# Altium project PCB.PrjPcb
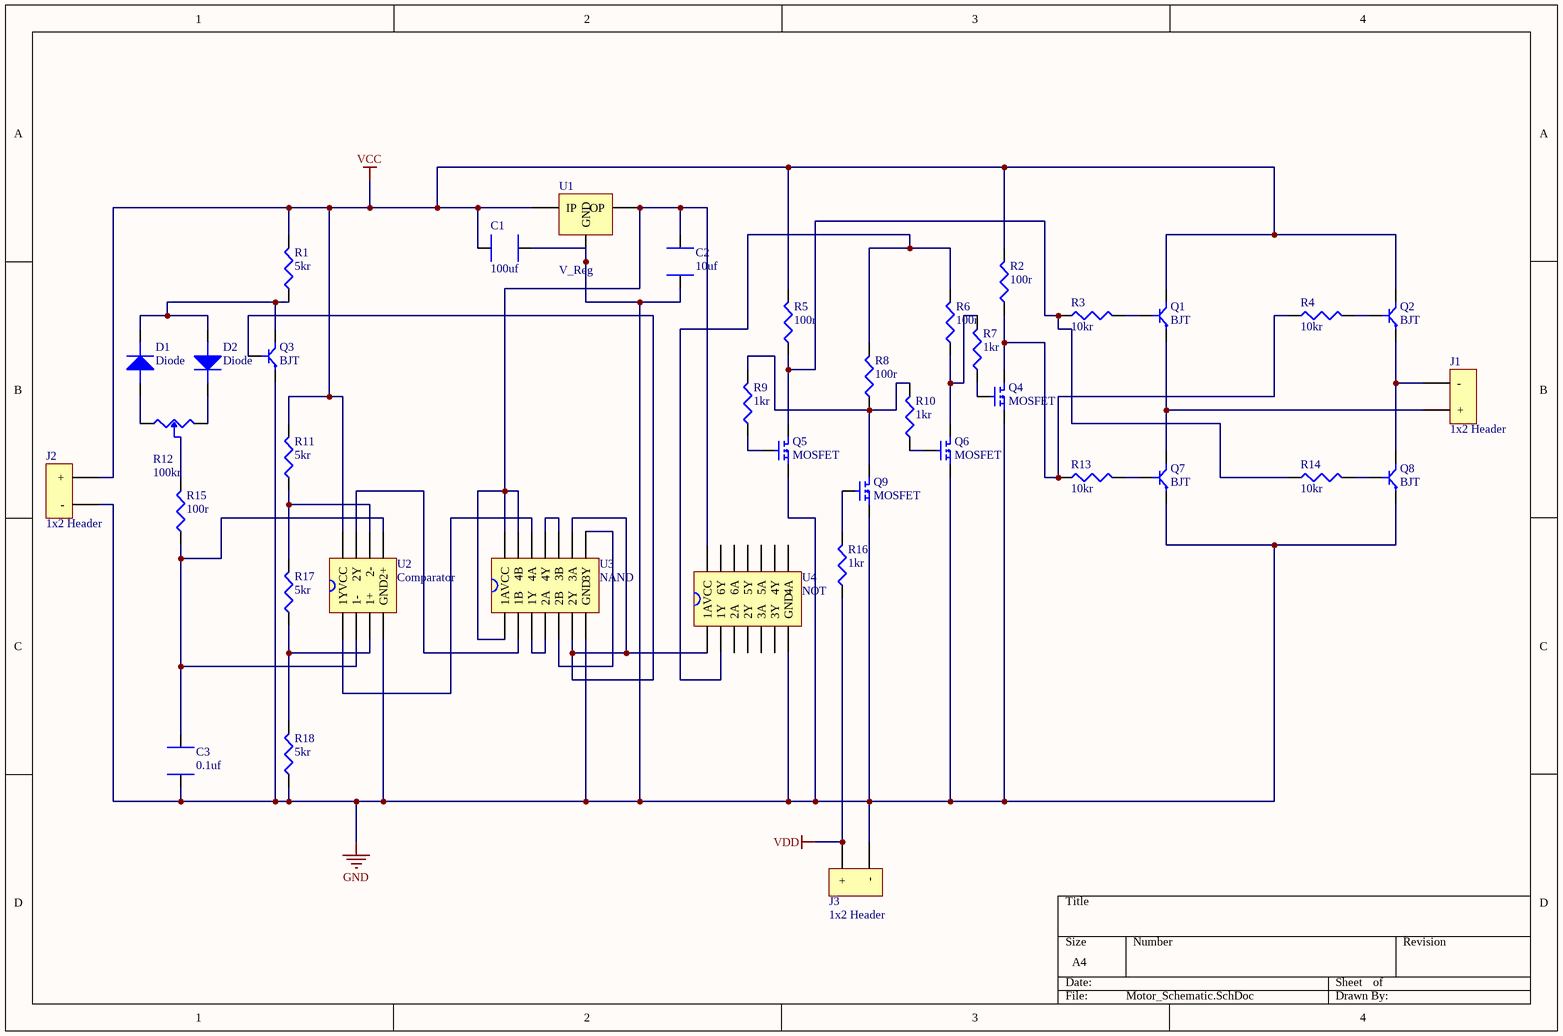
[diagram p0: Motor_Schematic.SchDoc]
1 sheet, 39 parts. Net scope: global (net labels, ports and power ports of the same name join across sheets).
Board file: Motor_PCB.PcbDoc

## Sheet Motor_Schematic.SchDoc
size A4

### Parts
C1  100uf  [100UF]
C2  10uf  [10UF]
C3  0.1uf  [0.1UF]
D1  Diode  [Diode]
D2  Diode  [Diode]
J1  1x2 Header  [HDR1X2]
J2  1x2 Header  [HDR1X2]
J3  1x2 Header  [HDR1X2]
Q1  BJT  [BJT]
Q2  BJT  [BJT]
Q3  BJT  [BJT]
Q4  MOSFET  [MOSFET]
Q5  MOSFET  [MOSFET]
Q6  MOSFET  [MOSFET]
Q7  BJT  [BJT]
Q8  BJT  [BJT]
Q9  MOSFET  [MOSFET]
R1  5kr  [5KR]
R2  100r  [100R]
R3  10kr  [10kr]
R4  10kr  [10kr]
R5  100r  [100R]
R6  100r  [100R]
R7  1kr  [1KR]
R8  100r  [100R]
R9  1kr  [1KR]
R10  1kr  [1KR]
R11  5kr  [5KR]
R12  100kr  [POT]
R13  10kr  [10kr]
R14  10kr  [10kr]
R15  100r  [100R]
R16  1kr  [1KR]
R17  5kr  [5KR]
R18  5kr  [5KR]
U1  V_Reg  [V_REG]
U2  Comparator  [COMP]
U3  NAND  [NAND]
U4  NOT  [NOT]

### Nets
GND: C1.2 C2.1 C3.1 J2.2(-) J3.2(-) Q3.3 Q4.3 Q5.3 Q6.3 Q7.3 Q8.3 Q9.3 R18.1 U1.2(GND) U2.4(GND) U3.7(GND) U4.7(GND)
VCC: C1.1 J2.1(+) Q1.1 Q2.1 R1.2 R2.2 R5.2 R11.2 U1.1(IP) U2.8(VCC)
VDD: J3.1(+) R16.1
NetC2_2: C2.2 U1.3(OP) U3.1(1A) U3.13(4B) U3.14(VCC) U4.14(VCC)
NetC3_2: C3.2 R15.1 U2.2(1-) U2.5(2+)
NetD1_1: D1.1 D2.2 Q3.1 R1.1
NetD1_2: D1.2 R12.3
NetD2_1: D2.1 R12.1
NetJ1_1: J1.1(+) Q1.3 Q7.1
NetJ1_2: J1.2(-) Q2.3 Q8.1
NetQ1_2: Q1.2 R3.2
NetQ2_2: Q2.2 R4.2
NetQ3_2: Q3.2 U3.6(2Y) U3.9(3A) U4.1(1A)
NetQ4_1: Q4.1 R2.1 R4.1 R13.1
NetQ4_2: Q4.2 R7.1
NetQ5_1: Q5.1 R3.1 R5.1 R14.1
NetQ5_2: Q5.2 R9.1
NetQ6_1: Q6.1 R6.1 R7.2
NetQ6_2: Q6.2 R10.1
NetQ7_2: Q7.2 R13.2
NetQ8_2: Q8.2 R14.2
NetQ9_1: Q9.1 R8.1 R9.2 R10.2
NetQ9_2: Q9.2 R16.2
NetR6_2: R6.2 R8.2 U4.2(1Y)
NetR11_1: R11.1 R17.2 U2.6(2-)
NetR12_2: R12.2 R15.2
NetR17_1: R17.1 R18.2 U2.3(1+)
NetU2_1: U2.1(1Y) U3.12(4A)
NetU2_7: U2.7(2Y) U3.2(1B)
NetU3_3: U3.3(1Y) U3.4(2A)
NetU3_5: U3.5(2B) U3.8(3Y)
NetU3_10: U3.10(3B) U3.11(4Y)

Not connected (* = marked no-connect by the designer): U4 3(2A) 4(2Y) 5(3A) 6(3Y) 8(4A) 9(4Y) 10(5A) 11(5Y) 12(6A) 13(6Y)

### Library data of the parts
C1 = FK22Y5V1A107Z: CAP CER 100UF 10V Y5V RADIAL; Manufacturer: TDK; Tolerance: 80%; Lead/Base Style: Kinked; Lead Length: 7mm; Supplier 1: Avnet; Supplier Part Number 1: FK22Y5V1A107Z; Manufacturer Part Number: FK22Y5V1A107Z; RoHS: Yes; Category: Ceramic Capacitors; Mount: Through Hole; Case/Package: Radial; Min Operating Temperature: -30°C; Max Operating Temperature: 85°C; Packaging: Bulk; Capacitance: 100uF; Package Quantity: 500; Voltage Rating: 10V; Dielectric: Y5V; Termination: Radial; Voltage Rating (DC): 10V; Series: FK; Length: 0.295inch; Width: 0.157inch; Height: 8mm; Lead Pitch: 5mm; Height - Seated (Max): 0.315inch; Radiation Hardening: No; Lead Free: Lead Free; RoHS Compliant: Yes; ComponentLink1URL: https://datasheet.ciiva.com/160/leadmlcc-commercial-general-en-160679.pdf?src-supplier=Digi-Key; ComponentLink1Description: https://datasheet.ciiva.com/160/leadmlcc-commercial-general-en-160679.pdf?src-supplier=Digi-Key
C2 = FK20X7R1E106MR000: Cap Ceramic 10uF 25V X7R 20% Radial 5mm 125°C Bulk; Manufacturer: TDK; Supplier 1: DigiKey; Supplier Part Number 1: 445-FK20X7R1E106MR000-ND; Manufacturer Part Number: FK20X7R1E106MR000; Category: Ceramic Capacitors; Stock 1: 500; Pricing 1: 1=0.87000, 10=0.64200, 50=0.51340, 100=0.44010, 500=0.34840, 1000=0.29339, 2500=0.27506, 5000=0.25672 (USD); Case/Package: Radial; ComponentLink1URL: http://product.tdk.com/en/catalog/datasheets/leadmlcc_commercial_general_en.pdf?src-supplier=Avnet; ComponentLink1Description: http://product.tdk.com/en/catalog/datasheets/leadmlcc_commercial_general_en.pdf?src-supplier=Avnet
C3 = M39014/01-1553: Cap Ceramic 0.1uF 50V X7R 10% Radial 5.08mm (0.01%FR) 125°C Bulk; Manufacturer: KEMET; Capacitance: 100nF; Lead/Base Style: Formed Leads; Supplier 1: Digi-Key; Supplier Part Number 1: 1001-2186-ND; Manufacturer Part Number: M39014/01-1553; RoHS: No; Category: Ceramic Capacitors; Stock 1: 21269; Pricing 1: 1=1.75000, 10=1.38200, 50=1.19780, 100=1.03650, 500=0.78316, 1000=0.69102, 2500=0.64495, 5000=0.62192 (USD); Mount: Through Hole; Case/Package: Radial; Min Operating Temperature: -55°C; Max Operating Temperature: 125°C; Tolerance: 10%; Packaging: Bulk; Package Quantity: 100; Voltage Rating: 50V; Dielectric: X7R; Failure Rate: 0.01%; Features: Military; Series: Military, MIL-PRF-39014, CKR05; Construction: RADIAL; Length: 0.19inch; Width: 0.09inch; Height - Seated (Max): 0.2inch; Lead Pitch: 0.2inch; Depth: 2.29mm; RoHS Compliant: No; ComponentLink1URL: http://components.arrow.com/part/dataview/4268595S5964331N4387?src-supplier=Arrow+Electronics; ComponentLink1Description: http://components.arrow.com/part/dataview/4268595S5964331N4387?src-supplier=Arrow+Electronics; ComponentLink2URL: http://www.kemet.com/docfinder?Partnumber=C052T104K5X5CR&src-supplier=Digi-Key; ComponentLink2Description: http://www.kemet.com/docfinder?Partnumber=C052T104K5X5CR&src-supplier=Digi-Key
D1 D2 = 1N4001G-T: DIODE GEN PURP 50V 1A DO41; Manufacturer: Diodes; Max Surge Current: 30A; Recovery Time: 2us; Forward Voltage: 1V; Max Reverse Current: 5uA; Element Configuration: Single; Polarity: Standard; Capacitance: 8pF; Supplier 1: Digi-Key; Supplier Part Number 1: 1N4001GDICT-ND; Manufacturer Part Number: 1N4001G-T; RoHS: Yes; Category: Rectifier Diodes; Stock 1: 29157; Pricing 1: 1=0.33000, 10=0.27300, 100=0.14480, 500=0.09528, 1000=0.06480, 2000=0.05845 (USD); Mount: Through Hole; Case/Package: DO-41; Number of Pins: 2; Weight: 0.010582oz; Contact Plating: Tin; Min Operating Temperature: -65°C; Max Operating Temperature: 175°C; Package Quantity: 5000; Packaging: Tape and Reel; Reverse Voltage (DC): 50V; Average Rectified Current: 1A; Reverse Recovery Time: 2us; Max Repetitive Reverse Voltage (Vrrm): 50V; Peak Non-Repetitive Surge Current: 30A; Forward Current: 1A; Voltage Rating (DC): 50V; Current Rating: 1A; Output Current: 1A; Max Reverse Voltage (DC): 50V; Series: -; Length: 5.21mm; Width: 2.72mm; Height: 2.72mm; Radiation Hardening: No; Lead Free: Lead Free; RoHS Compliant: Yes; ComponentLink1URL: https://datasheet.ciiva.com/4453/ds29002-87001-4453648.pdf?src-supplier=Mouser; ComponentLink1Description: https://datasheet.ciiva.com/4453/ds29002-87001-4453648.pdf?src-supplier=Mouser; ComponentLink2URL: https://datasheet.ciiva.com/8301/ds29002-8301703.pdf?src-supplier=Avnet; ComponentLink2Description: https://datasheet.ciiva.com/8301/ds29002-8301703.pdf?src-supplier=Avnet; ComponentLink3URL: https://datasheet.ciiva.com/25947/ds29002-25947001.pdf?src-supplier=Avnet+Europe; ComponentLink3Description: https://datasheet.ciiva.com/25947/ds29002-25947001.pdf?src-supplier=Avnet+Europe
J1-J3 = 22-29-2021: Conn Wire to Board HDR 2 POS 2.54mm Solder ST Thru-Hole Bag; Manufacturer: Molex; Number of Positions: 2; Connector Type: Header,Male Pin; Gender: Male; Voltage Rating (DC): 250V; Contact Post Length: 0.14inch; Glow Wire Compliant: Non-compliant; Supplier 1: Avnet; Supplier Part Number 1: 0022292021; Manufacturer Part Number: 22-29-2021; RoHS: Yes; Category: Headers and Wire Housings; Stock 1: 41330; Pricing 1: 1=0.20078, 10=0.19794, 30=0.19509, 50=0.19224, 100=0.18797, 250=0.18370, 500=0.17942 (USD); Mount: Through Hole; Color: White; Contact Plating: Gold; Contact Material: Brass; Contact Shape: Square; Insulation Material: Nylon; Insulation Color: Natural; Max Operating Temperature: 80°C; Number of Rows: 1; Packaging: Bag; Termination: Solder; Fastening Type: Friction; Contact Mating Length: 0.295inch; Insulation Height: 0.461inch; Lead Free: Lead Free; Halogen Free: Low Halogen; Flammability Rating: UL94 V-0; ComponentLink1URL: https://datasheet.ciiva.com/70131/022292021-sd-70131706.pdf?src-supplier=Digi-Key; ComponentLink1Description: https://datasheet.ciiva.com/70131/022292021-sd-70131706.pdf?src-supplier=Digi-Key
Q1-Q3 Q7 Q8 = 2N2222A: TRANS NPN 40V 0.8A TO-18; Manufacturer: Central Semiconductor; Frequency: 250MHz; hFE Min: 35; Max Power Dissipation: 500mW; Collector Base Voltage (VCBO): 75V; Emitter Base Voltage (VEBO): 6V; Collector Emitter Saturation Voltage: 1V; Max Collector Current: 800mA; Transition Frequency: 300MHz; Number of Elements: 1; Power Dissipation: 1.2W; Element Configuration: Single; Supplier 1: Digi-Key; Supplier Part Number 1: 1514-2N2222APBFREE-ND; Manufacturer Part Number: 2N2222A; RoHS: No; Category: BJTs; Stock 1: 19427; Pricing 1: 1=2.48000, 10=2.22500, 25=2.09880, 100=1.78820, 500=1.46916, 1000=1.21730, 2500=1.18800 (USD); Mount: Through Hole; Case/Package: TO-18; Number of Pins: 3; Min Operating Temperature: -65°C; Max Operating Temperature: 200°C; Packaging: Bulk; Package Quantity: 2000; Polarity: NPN; Collector Emitter Voltage (VCEO): 40V; Collector Emitter Breakdown Voltage: 40V; Max Frequency: 300MHz; Gain Bandwidth Product: 300MHz; Series: -; Collector-emitter Voltage-Max: 1V; Radiation Hardening: No; RoHS Compliant: No; Lead Free: Lead Free; ComponentLink1URL: https://datasheet.ciiva.com/16286/2n2221a-16286747.pdf?src-supplier=Future+Electronics; ComponentLink1Description: https://datasheet.ciiva.com/16286/2n2221a-16286747.pdf?src-supplier=Future+Electronics
Q4-Q6 Q9 = 2N7000TA: Trans MOSFET N-CH 60V 0.2A 3-Pin TO-92 Ammo; Manufacturer: ON Semiconductor / Fairchild; Element Configuration: Single; Current Rating: 200mA; Fall Time: 10ns; Power Dissipation: 400mW; Drain to Source Resistance: 1.2R; Gate to Source Voltage (Vgs): 30V; Threshold Voltage: 3.9V; On-State Resistance: 5R; Input Capacitance: 50pF; Number of Elements: 1; Supplier 1: Digi-Key; Supplier Part Number 1: 2N7000TACT-ND; Manufacturer Part Number: 2N7000TA; RoHS: Yes; Category: MOSFETs; Stock 1: 145929; Pricing 1: 1=0.46000, 10=0.34300, 25=0.30040, 100=0.19430, 500=0.12870, 1000=0.09867 (USD); Mount: Through Hole; Case/Package: TO-92-3; Number of Pins: 3; Contact Plating: Copper,Tin,Silver; Min Operating Temperature: -55°C; Max Operating Temperature: 150°C; Voltage Rating (DC): 60V; Continuous Drain Current (ID): 200mA; Drain to Source Breakdown Voltage: 60V; Turn-Off Delay Time: 10ns; Drain to Source Voltage (Vdss): 60V; Turn-On Delay Time: 10ns; Package Quantity: 2000; Rise Time: 10ns; Max Power Dissipation: 400mW; Rds On Max: 5R; Packaging: Ammo Pack; Length: 5.2mm; Width: 4.19mm; Height: 5.33mm; Radiation Hardening: No; Lead Free: Lead Free; REACH SVHC: No SVHC; ComponentLink1URL: https://datasheet.ciiva.com/16743/2n7000ta-16743696.pdf?src-supplier=Future+Electronics; ComponentLink1Description: https://datasheet.ciiva.com/16743/2n7000ta-16743696.pdf?src-supplier=Future+Electronics; ComponentLink2URL: https://datasheet.ciiva.com/25625/0900766b80f9a390-25625193.pdf?src-supplier=RSComponents; ComponentLink2Description: https://datasheet.ciiva.com/25625/0900766b80f9a390-25625193.pdf?src-supplier=RSComponents; ComponentLink3URL: https://datasheet.ciiva.com/4440/2n7000bu-8139-4440256.pdf?src-supplier=Mouser; ComponentLink3Description: https://datasheet.ciiva.com/4440/2n7000bu-8139-4440256.pdf?src-supplier=Mouser; ComponentLink4URL: https://datasheet.ciiva.com/46422/1863369-46422102.pdf?src-supplier=Element14; ComponentLink4Description: https://datasheet.ciiva.com/46422/1863369-46422102.pdf?src-supplier=Element14; ComponentLink5URL: https://datasheet.ciiva.com/931/2n7000-931787.pdf?src-supplier=Digi-Key; ComponentLink5Description: https://datasheet.ciiva.com/931/2n7000-931787.pdf?src-supplier=Digi-Key; ComponentLink6URL: https://datasheet.ciiva.com/931/2n7000-931786.pdf?src-supplier=Digi-Key; ComponentLink6Description: https://datasheet.ciiva.com/931/2n7000-931786.pdf?src-supplier=Digi-Key; ComponentLink7URL: https://datasheet.ciiva.com/15208/getdatasheetpartid-157593-15208444.pdf?src-supplier=Verical; ComponentLink7Description: https://datasheet.ciiva.com/15208/getdatasheetpartid-157593-15208444.pdf?src-supplier=Verical
R1 R11 R17 R18 = RN55D5001FB14: Metal Film Resistors - Through Hole 1/8watt 5Kohms 1% 100ppm Non Std; Manufacturer: Vishay Dale; Power Rating: 125mW; Voltage Rating: 250V; Temperature Coefficient: 100ppm/°C; Lead Diameter: 0.64mm; Supplier 1: Digi-Key; Supplier Part Number 1: RN55D5001FB14-ND; Manufacturer Part Number: RN55D5001FB14; RoHS: No; Category: Through-Hole Resistors; Stock 1: 711; Pricing 1: 1=0.58000, 10=0.44800, 25=0.34120, 50=0.25360, 100=0.18850, 250=0.15924, 500=0.13650, 1000=0.10400, 5000=0.08775 (USD); Case/Package: Axial; Number of Pins: 2; Min Operating Temperature: -65°C; Max Operating Temperature: 175°C; Package Quantity: 100; Resistance: 5kR; Tolerance: 1%; Packaging: Bulk; Resistor Type: Metal Film; Termination: Axial; Number of Terminations: 2; Max Power Dissipation: 125mW; Voltage Rating (DC): 250V; Features: Moisture Resistant,Military,Flame Retardant Coating; Series: Military, MIL-R-10509/7, RN55; Resistance Tolerance: 1%; Length: 0.24inch; Width: 2.29mm; REACH SVHC: Unknown; Lead Free: Contains Lead; RoHS Compliant: No; ComponentLink1URL: https://datasheet.ciiva.com/22672/1847593-22672521.pdf?src-supplier=Element14; ComponentLink1Description: https://datasheet.ciiva.com/22672/1847593-22672521.pdf?src-supplier=Element14; ComponentLink2URL: https://datasheet.ciiva.com/5491/cmfmil-223788-5491847.pdf?src-supplier=Mouser; ComponentLink2Description: https://datasheet.ciiva.com/5491/cmfmil-223788-5491847.pdf?src-supplier=Mouser; ComponentLink3URL: https://datasheet.ciiva.com/13956/cmfmil-13956108.pdf?src-supplier=Digi-Key; ComponentLink3Description: https://datasheet.ciiva.com/13956/cmfmil-13956108.pdf?src-supplier=Digi-Key
R2 R5 R6 R8 R15 = CPF1100R00JKEE6: RESISTOR METAL FILM 1W 100 OHM; Manufacturer: Vishay Dale; Tolerance: 5%; Temperature Coefficient: 100ppm/°C; Supplier 1: Digi-Key; Supplier Part Number 1: CPF100DCT-ND; Manufacturer Part Number: CPF1100R00JKEE6; RoHS: Yes; Category: Through-Hole Resistors; Stock 1: 368; Pricing 1: 1=0.69000, 10=0.57400, 25=0.49200, 50=0.44280, 100=0.38540, 250=0.34440, 500=0.27880 (USD); Case/Package: Axial; Min Operating Temperature: -65°C; Max Operating Temperature: 230°C; Package Quantity: 1; Resistance: 100R; Packaging: Tape and Reel; Resistor Type: Metal Film; Number of Terminations: 2; Max Power Dissipation: 1W; Series: CPF; Features: Moisture Resistant; Length: 0.24inch; RoHS Compliant: Yes; ComponentLink1URL: https://datasheet.ciiva.com/2718/cpf-2718963.pdf?src-supplier=Digi-Key; ComponentLink1Description: https://datasheet.ciiva.com/2718/cpf-2718963.pdf?src-supplier=Digi-Key; ComponentLink2URL: https://datasheet.ciiva.com/2718/cpf-2718964.pdf?src-supplier=Digi-Key; ComponentLink2Description: https://datasheet.ciiva.com/2718/cpf-2718964.pdf?src-supplier=Digi-Key
R3 R4 R13 R14 = CPF110K000FKEE6: RESISTOR METAL FILM 1W 10.0K OHM; Manufacturer: Vishay Dale; Tolerance: 1%; Voltage Rating: 250V; Temperature Coefficient: 100ppm/°C; Lead Diameter: 0.64mm; Supplier 1: Digi-Key; Supplier Part Number 1: CPF10.0KCCT-ND; Manufacturer Part Number: CPF110K000FKEE6; RoHS: Yes; Category: Through-Hole Resistors; Stock 1: 37314; Pricing 1: 1=0.72000, 10=0.60200, 25=0.51600, 50=0.46440, 100=0.40420, 250=0.36120, 500=0.29240 (USD); Mount: Through Hole; Case/Package: Axial; Min Operating Temperature: -65°C; Max Operating Temperature: 230°C; Resistance: 10kR; Power Rating: 1W; Packaging: Tape and Reel; Package Quantity: 1; Resistor Type: Metal Film; Termination: Axial; Number of Terminations: 2; Max Power Dissipation: 1W; Features: Moisture Resistant; Series: CPF; Length: 0.24inch; RoHS Compliant: Yes; ComponentLink1URL: https://datasheet.ciiva.com/2725/cpf-2725244.pdf?src-supplier=Digi-Key; ComponentLink1Description: https://datasheet.ciiva.com/2725/cpf-2725244.pdf?src-supplier=Digi-Key; ComponentLink2URL: https://datasheet.ciiva.com/2725/cpf-2725245.pdf?src-supplier=Digi-Key; ComponentLink2Description: https://datasheet.ciiva.com/2725/cpf-2725245.pdf?src-supplier=Digi-Key
R7 R9 R10 R16 = MR1061K0000TAE66: RESISTOR 1.0K OHM 1/4W .01% WW; Manufacturer: Vishay Dale; Tolerance: 0.01%; Max Power Dissipation: 250mW; Temperature Coefficient: 10ppm/°C; Supplier 1: Digi-Key; Supplier Part Number 1: MR106-1K-.01-ND; Manufacturer Part Number: MR1061K0000TAE66; RoHS: Yes; Category: Through-Hole Resistors; Stock 1: 105; Pricing 1: 1=6.60000, 10=6.18800, 25=5.77520, 50=5.08760, 100=4.40000 (USD); Case/Package: Axial; Min Operating Temperature: -55°C; Max Operating Temperature: 145°C; Packaging: Bulk; Resistance: 1kR; Resistor Type: Wirewound; Number of Terminations: 2; Package Quantity: 5; Series: MR100; Length: 0.5inch; RoHS Compliant: Yes; ComponentLink1URL: https://datasheet.ciiva.com/6494/mr100-6494940.pdf?src-supplier=Digi-Key; ComponentLink1Description: https://datasheet.ciiva.com/6494/mr100-6494940.pdf?src-supplier=Digi-Key
R12 = 89PR100KLF: TRIMMER 100K OHM 0.75W PC PIN; Manufacturer: TT BI; Tolerance: 10%; Power Rating: 750mW; Number of Turns: 20; Temperature Coefficient: 100ppm/°C; Voltage Rating (DC): 200V; Supplier 1: Digi-Key; Supplier Part Number 1: 987-1158-ND; Manufacturer Part Number: 89PR100KLF; RoHS: Yes; Category: Variable Resistors and Potentiometers; Stock 1: 1116; Pricing 1: 1=1.75000, 10=1.53700, 25=1.37800, 50=1.32500, 100=1.27200, 250=1.21900, 500=1.00700, 1000=0.95400, 5000=0.79500 (USD); Mount: Through Hole; Weight: 1.4g; Min Operating Temperature: -55°C; Max Operating Temperature: 125°C; Resistance: 100kR; Package Quantity: 100; Packaging: Bulk; Resistor Type: Cermet; Termination: Pin; Taper: Linear; Max Power Dissipation: 750mW; Type: Potentiometer; Series: 89; Technology: CERMET; Resistance Tolerance: 10%; Length: 20.57mm; Height: 0.25inch; Depth: 4.83mm; Radiation Hardening: No; REACH SVHC: No SVHC; Military Standard: Not; Lead Free: Lead Free; RoHS Compliant: Yes; ComponentLink1URL: http://www.farnell.com/datasheets/1910176.pdf?src-supplier=Farnell; ComponentLink1Description: http://www.farnell.com/datasheets/1910176.pdf?src-supplier=Farnell; ComponentLink2URL: http://www.mouser.com/ds/2/414/89-9791.pdf?src-supplier=Mouser; ComponentLink2Description: http://www.mouser.com/ds/2/414/89-9791.pdf?src-supplier=Mouser; ComponentLink3URL: http://components.arrow.com/part/dataview/0323_03829868?src-supplier=Arrow+Europe; ComponentLink3Description: http://components.arrow.com/part/dataview/0323_03829868?src-supplier=Arrow+Europe; ComponentLink4URL: http://www.bitechnologies.com/pdfs/89.pdf?src-supplier=Future+Electronics; ComponentLink4Description: http://www.bitechnologies.com/pdfs/89.pdf?src-supplier=Future+Electronics; ComponentLink5URL: http://www.ttelectronics.com/sites/default/files/download-files/Datasheet_MultiTurn%20Trimmer_89%20and%2090.pdf?src-supplier=Digi-Key; ComponentLink5Description: http://www.ttelectronics.com/sites/default/files/download-files/Datasheet_MultiTurn%20Trimmer_89%20and%2090.pdf?src-supplier=Digi-Key; ComponentLink6URL: https://www.verical.com/server-webapp/html/getDatasheet?partID=122944&src-supplier=Verical; ComponentLink6Description: https://www.verical.com/server-webapp/html/getDatasheet?partID=122944&src-supplier=Verical; ComponentLink7URL: http://www.farnell.com/datasheets/1910176.pdf?src-supplier=Element14; ComponentLink7Description: http://www.farnell.com/datasheets/1910176.pdf?src-supplier=Element14; ComponentLink8URL: http://components.arrow.com/part/dataview/42291488S7454187N1290?src-supplier=Arrow+Electronics; ComponentLink8Description: http://components.arrow.com/part/dataview/42291488S7454187N1290?src-supplier=Arrow+Electronics
U1 = LM340T-5.0: IC REG LINEAR 5V 1A TO220-3; Manufacturer: TI National Semiconductor; Number of Outputs: 1; Min Input Voltage: 7.5V; Max Input Voltage: 35V; Dropout Voltage: 2V; Polarity: Positive; Quiescent Current: 8mA; Accuracy: 2%; Power Supply Rejection Ratio (PSRR): 80dB; Output Type: Fixed; Supplier 1: Digi-Key; Supplier Part Number 1: 296-39011-5-ND; Manufacturer Part Number: LM340T-5.0; RoHS: No; Category: Voltage Regulators - Linear; Stock 1: 1404; Pricing 1: 1=2.34000, 10=2.10400, 25=1.98480, 100=1.69110, 250=1.58788, 500=1.38940, 1000=1.31075 (USD); Mount: Through Hole; Case/Package: TO-220; Number of Pins: 3; Weight: 0.08113oz; Contact Plating: Tin,Lead; Min Operating Temperature: 0°C; Max Operating Temperature: 125°C; Packaging: Rail/Tube; Max Output Current: 1A; Output Voltage: 5V; Output Current: 1A; Nominal Output Voltage: 5V; Number of Regulators: 1; Max Output Voltage: 5V; Output Voltage Accuracy: 2%; Current Rating: 1A; Series: -; Length: 10.16mm; Width: 4.7mm; Height: 8.89mm; REACH SVHC: No SVHC; Lead Free: Contains Lead; RoHS Compliant: No; ComponentLink1URL: https://datasheet.ciiva.com/26904/lm340t-5-0-26904953.pdf?src-supplier=IIIC; ComponentLink1Description: https://datasheet.ciiva.com/26904/lm340t-5-0-26904953.pdf?src-supplier=IIIC; ComponentLink2URL: https://datasheet.ciiva.com/1512/1888853-1512093.pdf?src-supplier=Element14; ComponentLink2Description: https://datasheet.ciiva.com/1512/1888853-1512093.pdf?src-supplier=Element14
U2 = LM2903DMR2G: Comparator Dual ±18V/36V 8-Pin Micro T/R; Manufacturer: ON Semiconductor; Number of Elements: 2; Voltage Gain: 106.02dB; Min Supply Voltage: 2V; Max Supply Voltage: 36V; Min Dual Supply Voltage: 1V; Max Dual Supply Voltage: 18V; Nominal Supply Current: 1mA; Max Power Dissipation: 570mW; Input Offset Voltage (Vos): 7mV; Input Bias Current: 250nA; Output Current: 16mA; Quiescent Current: 2.5mA; Response Time: 1.5us; Output Type: TTL; Output Compatibility: CMOS; Supplier 1: RSComponents; Supplier Part Number 1: 7878241; Manufacturer Part Number: LM2903DMR2G; RoHS: Yes; Category: Comparators; Stock 1: 2960; Case/Package: MSOP; Number of Pins: 8; Contact Plating: Tin,Matte; Min Operating Temperature: -40°C; Max Operating Temperature: 105°C; Package Quantity: 4000; Number of Channels: 2; Packaging: Tape and Reel; Max Input Current: 250nA; Max Supply Current: 1mA; Output Current per Channel: 16mA; Power Dissipation: 570mW; Type: General Purpose; Supply Current: 1mA; Series: LM2903; Technology: BIPOLAR; Length: 3.1mm; Width: 3.1mm; Height: 0.95mm; Radiation Hardening: No; REACH SVHC: No SVHC; Lead Free: Lead Free; Halogen Free: Halogen Free; RoHS Compliant: Yes; ComponentLink1URL: https://datasheet.ciiva.com/30481/0900766b8124fc18-30481577.pdf?src-supplier=RSComponents; ComponentLink1Description: https://datasheet.ciiva.com/30481/0900766b8124fc18-30481577.pdf?src-supplier=RSComponents; ComponentLink2URL: https://datasheet.ciiva.com/1575/65410-1575986.pdf?src-supplier=Newark; ComponentLink2Description: https://datasheet.ciiva.com/1575/65410-1575986.pdf?src-supplier=Newark; ComponentLink3URL: https://datasheet.ciiva.com/1827/lm393-d-1827303.pdf?src-supplier=Digi-Key; ComponentLink3Description: https://datasheet.ciiva.com/1827/lm393-d-1827303.pdf?src-supplier=Digi-Key; ComponentLink4URL: https://datasheet.ciiva.com/2971/lm393-d-2971751.pdf?src-supplier=Avnet; ComponentLink4Description: https://datasheet.ciiva.com/2971/lm393-d-2971751.pdf?src-supplier=Avnet; ComponentLink5URL: https://datasheet.ciiva.com/26911/getdatasheetpartid-295472-26911255.pdf?src-supplier=Verical; ComponentLink5Description: https://datasheet.ciiva.com/26911/getdatasheetpartid-295472-26911255.pdf?src-supplier=Verical; ComponentLink6URL: https://datasheet.ciiva.com/1827/lm393-d-1827304.pdf?src-supplier=Digi-Key; ComponentLink6Description: https://datasheet.ciiva.com/1827/lm393-d-1827304.pdf?src-supplier=Digi-Key; ComponentLink7URL: https://datasheet.ciiva.com/26211/lm393-d-26211112.pdf?src-supplier=Avnet+Europe; ComponentLink7Description: https://datasheet.ciiva.com/26211/lm393-d-26211112.pdf?src-supplier=Avnet+Europe; ComponentLink8URL: https://datasheet.ciiva.com/1827/lm393-d-1827305.pdf?src-supplier=Digi-Key; ComponentLink8Description: https://datasheet.ciiva.com/1827/lm393-d-1827305.pdf?src-supplier=Digi-Key; ComponentLink9URL: https://datasheet.ciiva.com/16464/lm393-d-16464266.pdf?src-supplier=Avnet+Asia; ComponentLink9Description: https://datasheet.ciiva.com/16464/lm393-d-16464266.pdf?src-supplier=Avnet+Asia; ComponentLink10URL: https://datasheet.ciiva.com/2970/lm393-d-2970811.pdf?src-supplier=Avnet; ComponentLink10Description: https://datasheet.ciiva.com/2970/lm393-d-2970811.pdf?src-supplier=Avnet
U3 = SN74AS1000AN: NAND Gate 4-Element 2-IN Bipolar 14-Pin PDIP Tube; Manufacturer: Texas Instruments; Output Current: 48mA; Number of Inputs: 2; Min Supply Voltage: 4.5V; Max Supply Voltage: 5.5V; Propagation Delay: 4ns; Operating Supply Voltage: 5V; Number of Outputs: 1; Number of Circuits: 4; High Level Output Current: -48mA; Supplier 1: Digi-Key; Supplier Part Number 1: 296-33786-5-ND; Manufacturer Part Number: SN74AS1000AN; RoHS: Yes; Category: Logic Gates; Stock 1: 98; Pricing 1: 1=3.31000, 10=2.97400, 25=2.81200, 100=2.43700, 250=2.31200, 500=2.07456, 1000=2.06325 (USD); Mount: Through Hole; Case/Package: PDIP; Number of Pins: 14; Weight: 0.032734oz; Min Operating Temperature: 0°C; Max Operating Temperature: 70°C; Max Output Current: 48mA; Packaging: Rail/Tube; Logic Function: NAND GATE; Package Quantity: 25; Low Level Output Current: 48mA; Number of Gates: 4; Number of Input Lines: 2; Number of Output Lines: 1; Turn-On Delay Time: 4ns; Number of Elements: 4; Termination: Through Hole; Number of Bits: 4; Radiation Hardening: No; REACH SVHC: No SVHC; Lead Free: Lead Free; RoHS Compliant: Yes; ComponentLink1URL: https://datasheet.ciiva.com/41457/001016459-da-01-en-ic-gate-qua-2in-sn74as1000an-pdip-14-tid-41457041.pdf?src-supplier=Conrad; ComponentLink1Description: https://datasheet.ciiva.com/41457/001016459-da-01-en-ic-gate-qua-2in-sn74as1000an-pdip-14-tid-41457041.pdf?src-supplier=Conrad; ComponentLink2URL: https://datasheet.ciiva.com/26262/sn74as1000a-26262535.pdf?src-supplier=Avnet+Europe; ComponentLink2Description: https://datasheet.ciiva.com/26262/sn74as1000a-26262535.pdf?src-supplier=Avnet+Europe; ComponentLink3URL: https://datasheet.ciiva.com/14292/sn74as1000a-14292252.pdf?src-supplier=Avnet; ComponentLink3Description: https://datasheet.ciiva.com/14292/sn74as1000a-14292252.pdf?src-supplier=Avnet
U4 = TC74AC14F(EL,F): Inverter Schmitt Trigger 6-Element CMOS 14-Pin SOP T/R; Manufacturer: Toshiba; Logic Function: Schmitt Trigger,Inverter; Low Level Output Current: 24mA; High Level Output Current: -24mA; Supplier 1: Digi-Key; Supplier Part Number 1: TC74AC14F(ELF)CT-ND; Manufacturer Part Number: TC74AC14F(EL,F); RoHS: Yes; Category: Logic Gates; Stock 1: 1; Pricing 1: 1=0.62000 (USD); Case/Package: SOP; Min Operating Temperature: -40°C; Max Operating Temperature: 85°C; Radiation Hardening: No; RoHS Compliant: Yes; ComponentLink1URL: http://www.semicon.toshiba.com.cn/info/docget.jsp?pid=TC74AC14P&lang=en&type=datasheet&src-supplier=Avnet; ComponentLink1Description: http://www.semicon.toshiba.com.cn/info/docget.jsp?pid=TC74AC14P&lang=en&type=datasheet&src-supplier=Avnet